# EAGLE design remote (EAGLE 9.6.2)

## Sheet 1 of 2
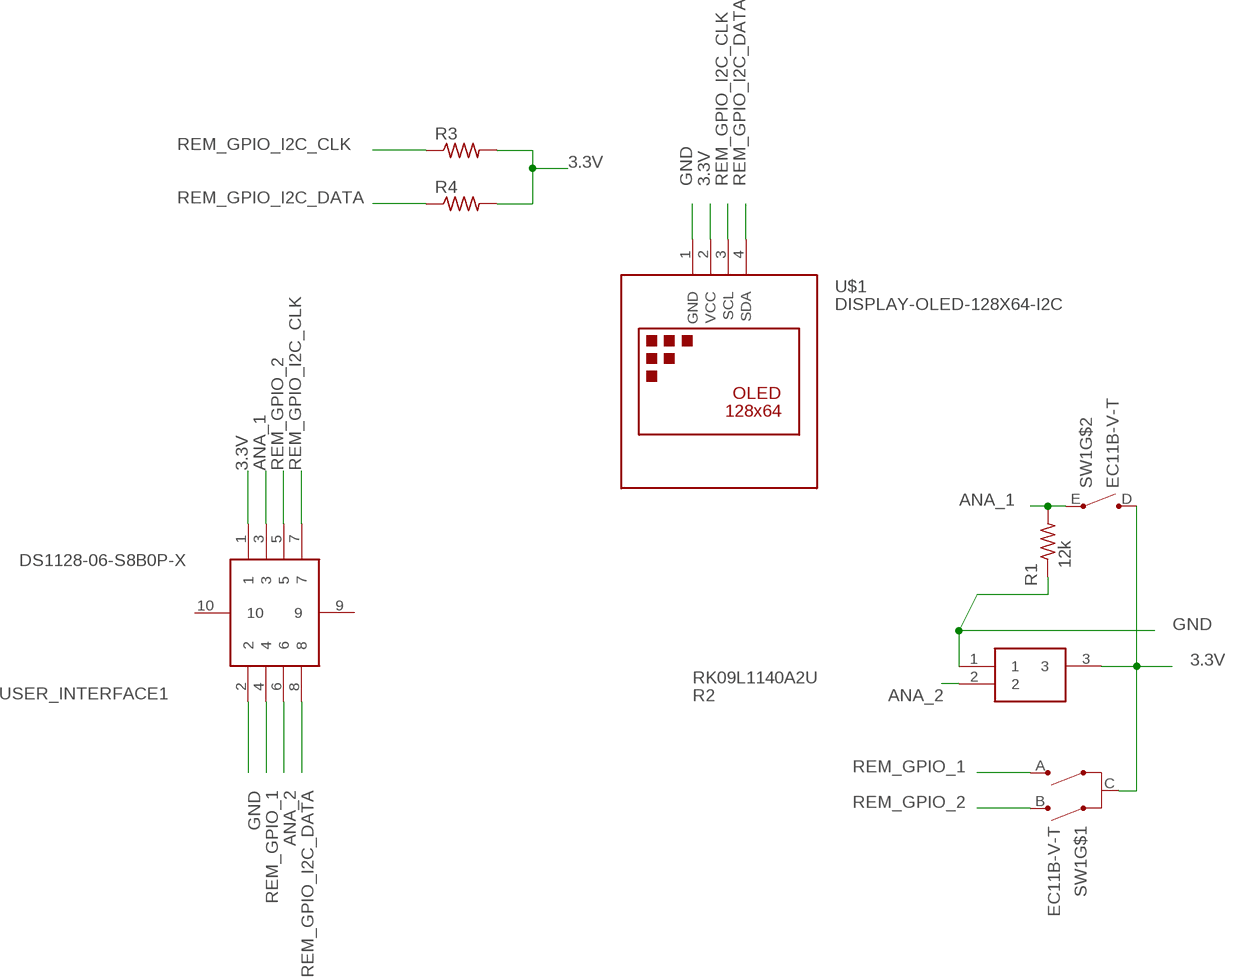
[diagram p0: schematic, sheet 1]

### Parts
R1  12k  R-US_R0805  [R0805]
R2  RK09L1140A2U  [RK09L1140A5E]
R3  R-US_R0805  [R0805]
R4  R-US_R0805  [R0805]
SW1  EC11B-V-T  [EC11B-V]
U$1  DISPLAY-OLED-128X64-I2C  [DISPLAY-OLED-128X64-I2C]
USER_INTERFACE1  DS1128-06-S8B0P-X  [DS112806S8B0PX]

### Nets
3.3V: R2.3 R3.2 R4.2 SW1.C SW1.D U$1.2(VCC) USER_INTERFACE1.1
ANA_1: R1.2 SW1.E USER_INTERFACE1.3
ANA_2: R2.2 USER_INTERFACE1.6
GND: R1.1 R2.1 U$1.1(GND) USER_INTERFACE1.2
REM_GPIO_1: SW1.A USER_INTERFACE1.4
REM_GPIO_2: SW1.B USER_INTERFACE1.5
REM_GPIO_I2C_CLK: R3.1 U$1.3(SCL) USER_INTERFACE1.7
REM_GPIO_I2C_DATA: R4.1 U$1.4(SDA) USER_INTERFACE1.8
Unconnected: USER_INTERFACE1.9 USER_INTERFACE1.10

## Sheet 2 of 2

## Library data of the parts
R1 R3 R4 = rcl:R-US_: RESISTOR, American symbol; SPICEPREFIX: R
R2 = RK09L1140A2U:RK09L1140A2U: Audio potentiometer 10K Vertical 20mm Alps RK09L Series, Linear Potentiometer with a 6 mm Dia. Shaft, 10k, +/-20%, 0.05W, Panel Mount (Through Hole) Source: Datasheet <http://docs-emea.rs-online.com/webdocs/0f4c/0900766b80f4c570.pdf>; DESCRIPTION: Audio potentiometer 10K Vertical 20mm Alps RK09L Series, Linear Potentiometer with a 6 mm Dia. Shaft, 10k, +/-20%, 0.05W, Panel Mount (Through Hole); HEIGHT: mm; MANUFACTURER_NAME: ALPS; MANUFACTURER_PART_NUMBER: RK09L1140A2U; MOUSER_PART_NUMBER: 688-RK09L1140A2U; MOUSER_PRICE-STOCK: https://www.mouser.co.uk/ProductDetail/ALPS/RK09L1140A2U?qs=6EGMNY9ZYDShe59Bf8g9AA%3D%3D
SW1 = alps:EC11B-V-T: ALPS EC11B Vertikal mit Taster Drehimpulsgeber 11mm
U$1 = diy-modules:DISPLAY-OLED-128X64-I2C: 128x64 Dot Matrix OLED Module based on SSD1306 chip Variant with I2C interface More details available here: http://www.instructables.com/id/Monochrome-096-i2c-OLED-display-with-arduino-SSD13/ SSD1306 datasheet: https://cdn-shop.adafruit.com/datasheets/SSD1306.pdf Click here to find device on ebay.com <http://www.ebay.com/sch/oled+display+128x64+iic> Note: There are two variants: I2C and SPI. Search for the proper version.
USER_INTERFACE1 = DS1128-06-S8B0P-X:DS1128-06-S8B0P-X: PCB Jack, 8 Positions Source: Datasheet <https://datasheet.lcsc.com/szlcsc/CONNFLY-Elec-DS1128-06-S8B0P-X_C86575.pdf>; DESCRIPTION: PCB Jack, 8 Positions; HEIGHT: 13.45mm; MANUFACTURER_NAME: Connfly; MANUFACTURER_PART_NUMBER: DS1128-06-S8B0P-X

## Net classes
0 default: clearance 0.205 mm

## Board
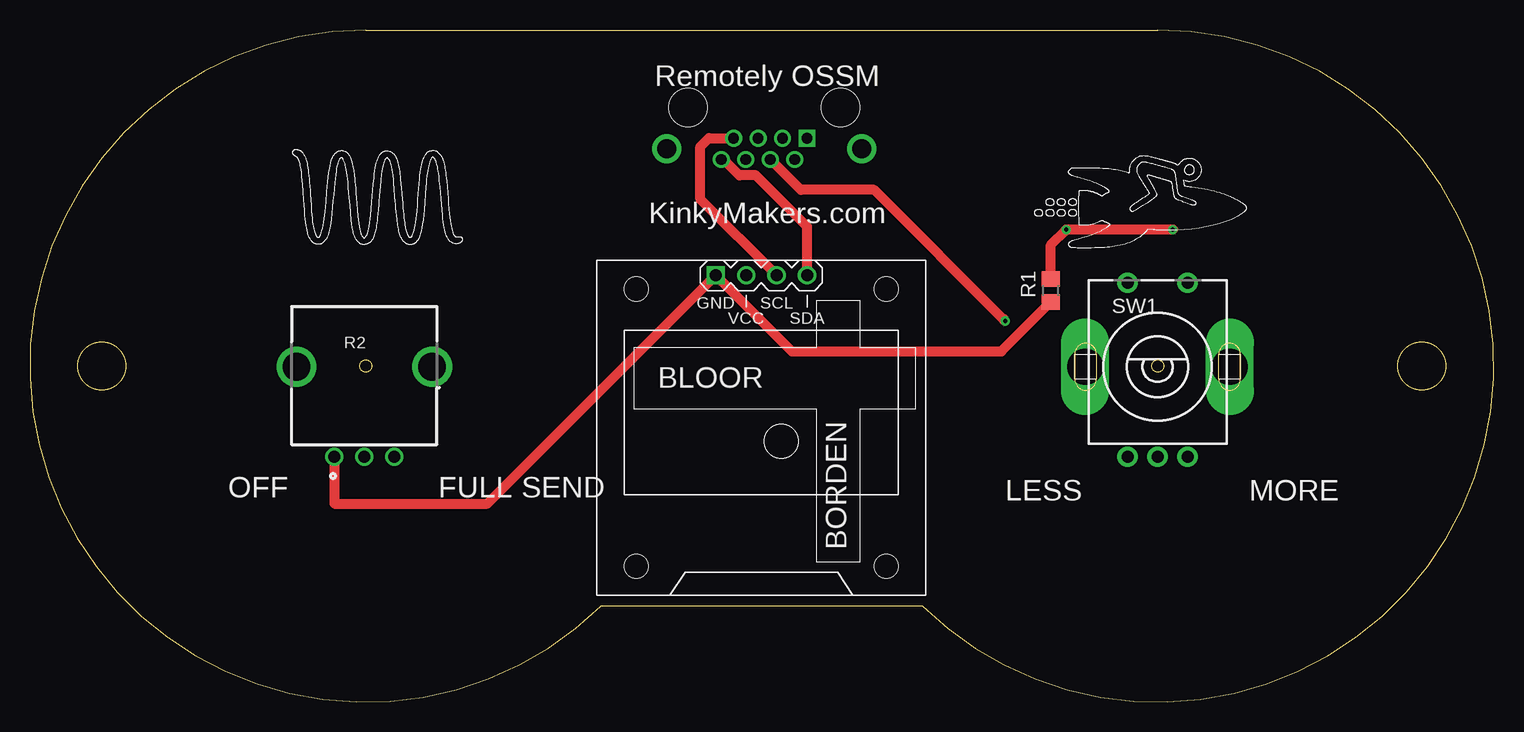
[diagram p1: board, top side]
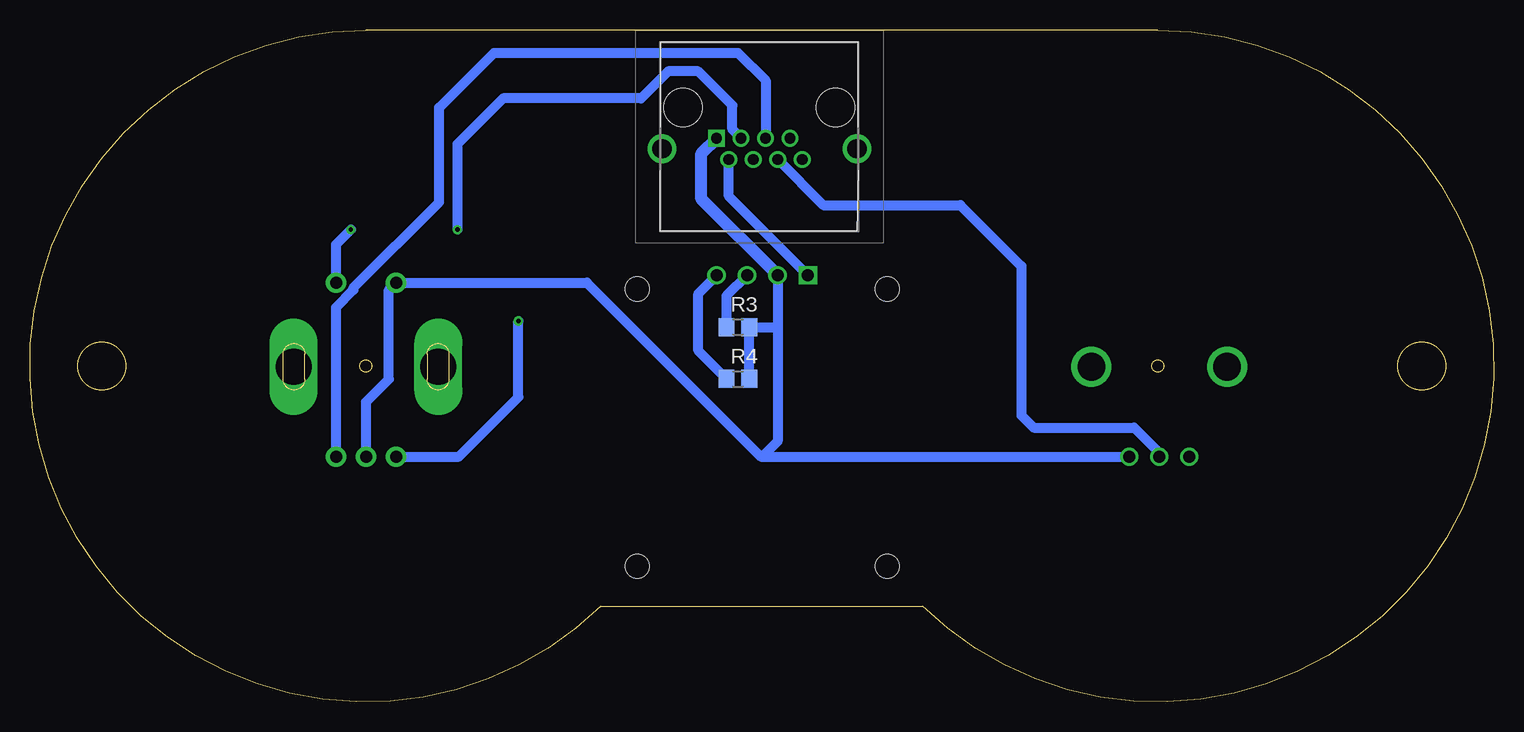
[diagram p2: board, bottom side, seen from below]

Size 121.96 x 55.99 mm. Coordinates in mm from the lower left corner, seen from the top.
Outline: 27.98,55.99 arc224 47.58,7.99 74.39,7.99 arc224 93.98,55.99 27.98,55.99
Outline: circle at 93.98,27.99 radius 0.5
Outline: circle at 27.98,27.99 radius 0.5
Outline: circle at 5.98,27.99 radius 2
Outline: circle at 115.98,27.99 radius 2
Copper layers (1*16): Top 0.035mm / dielectric 1.5mm / Bottom 0.035mm
Design rules "default": minimum track width 6mil, minimum drill 0.35mm, track to track 6mil, track to pad 6mil, pad to pad 6mil, via to via 6mil, smd to smd 6mil, copper to edge 40mil, drill to drill 6mil, minimum pad ring 10mil, minimum via ring 8mil, stop-mask expansion 4mil, vias tented up to drill 0mil, thermal gap 10mil

### Footprints (pad centres in the part's own frame; a part is rotated, then mirrored left to right if it is on the bottom)
R0805 = smd 1.3 x 1.5: 1 -0.95,0; 2 0.95,0
RK09L1140A5E = drill 1 pad 1.5: 1 -8.15,-7.5; 2 -5.65,-7.5; 3 -3.15,-7.5 | drill 2.31 pad 2.96: 4 0,0; 5 -11.3,0
EC11B-V = drill 1 pad 1.676: A -2.5,-7.5; B 2.5,-7.5; C 0,-7.5; D -2.5,7; E 2.5,7 | drill 3 pad 3.3 long: G1 -6.032,0; G2 6.032,0
DISPLAY-OLED-128X64-I2C = drill 1 square: 1 -3.81,12.7 | drill 1: 2 -1.27,12.7; 3 1.27,12.7; 4 3.81,12.7 | hole 2: -10.414,11.557; 10.414,11.557; 10.414,-11.557; -10.414,-11.557
DS112806S8B0PX = drill 0.9 pad 1.4 square: 1 0,0 | drill 0.9 pad 1.4: 2 -1.02,1.78; 3 -2.04,0; 4 -3.06,1.78; 5 -4.08,0; 6 -5.1,1.78; 7 -6.12,0; 8 -7.14,1.78 | drill 1.6 pad 2.4: 9 -11.7,0.89; 10 4.55,0.89 | hole 3.2: -9.92,-2.54; 2.78,-2.54

### Placement (x,y rotation side)
R1  85.07,34.28 90 top
R2  33.51,27.93 0 top
R3  62.97,31.23 0 bottom
R4  62.97,26.91 0 bottom
SW1  93.96,27.93 0 top
U$1  60.94,22.85 0 top
USER_INTERFACE1  64.75,46.98 180 bottom

### Tracks (layer width: path | path; a pad name or v marks a point on that pad's centre or on a via)
3.3V
  Bottom 0.813: SW1.C 93.96,24.99 92.06,26.9 92.06,34.33 SW1.D 75.56,34.93 61.06,20.43 60.94,20.43 | 60.94,20.43 R2.3 | U$1.2 59.67,31.23 | 59.67,31.23 59.67,21.7 60.94,20.43 | R4.2 R3.2 59.67,31.23
  Bottom 1.016: U$1.2 66.02,41.9 66.02,45.71 USER_INTERFACE1.1
ANA_1  (via drill 0.35)
  Top 0.813: v95.23,39.36 v86.34,39.36 85.07,38.09 R1.2
  Bottom 0.813: SW1.E 96.46,38.13 v95.23,39.36 | USER_INTERFACE1.3 63.44,47.7 63.44,49.7 66.28,52.54 68.78,52.54 71.04,50.28 82.53,50.28 86.34,46.47 v86.34,39.36
ANA_2
  Bottom 0.813: USER_INTERFACE1.6 55.84,41.39 44.43,41.39 39.35,36.31 39.35,23.86 38.34,22.85 29.95,22.85 27.86,20.75 R2.2
GND
  Top 0.813: R2.1 25.36,16.52 38.11,16.52 U$1.1 63.48,29.2 80.94,29.2 R1.1
  Bottom 0.813: U$1.1 63.73,42.15 USER_INTERFACE1.2
REM_GPIO_1  (via drill 0.35)
  Top 0.813: 81.01,31.99 v81.26,31.74 70.34,42.66 64.23,42.66 USER_INTERFACE1.4
  Bottom 0.813: SW1.A 86.22,20.43 81.26,25.39 v81.26,31.74
REM_GPIO_2
  Bottom 0.813: SW1.B 96.46,32.88 95.01,34.33 95.01,34.5 87.87,41.64 87.87,49.52 83.29,54.09 62.97,54.09 60.67,51.79 USER_INTERFACE1.5
REM_GPIO_I2C_CLK
  Top 0.813: U$1.3 55.86,41.9 55.86,46.27 56.57,46.98 USER_INTERFACE1.7
  Bottom 0.813: U$1.3 63.92,33.84 R3.1
REM_GPIO_I2C_DATA
  Top 0.813: U$1.4 64.75,39.61 60.48,43.88 59.11,43.88 57.79,45.2 USER_INTERFACE1.8
  Bottom 0.813: R4.1 66.28,29.26 66.28,34.02 U$1.4

### Text on the board
tNames: Remotely OSSM | KinkyMakers.com | BLOOR | OFF | FULL SEND | LESS | MORE | BORDEN